# EAGLE schematic anookum_main (EAGLE 7.3.0)

## Sheet 1 of 5
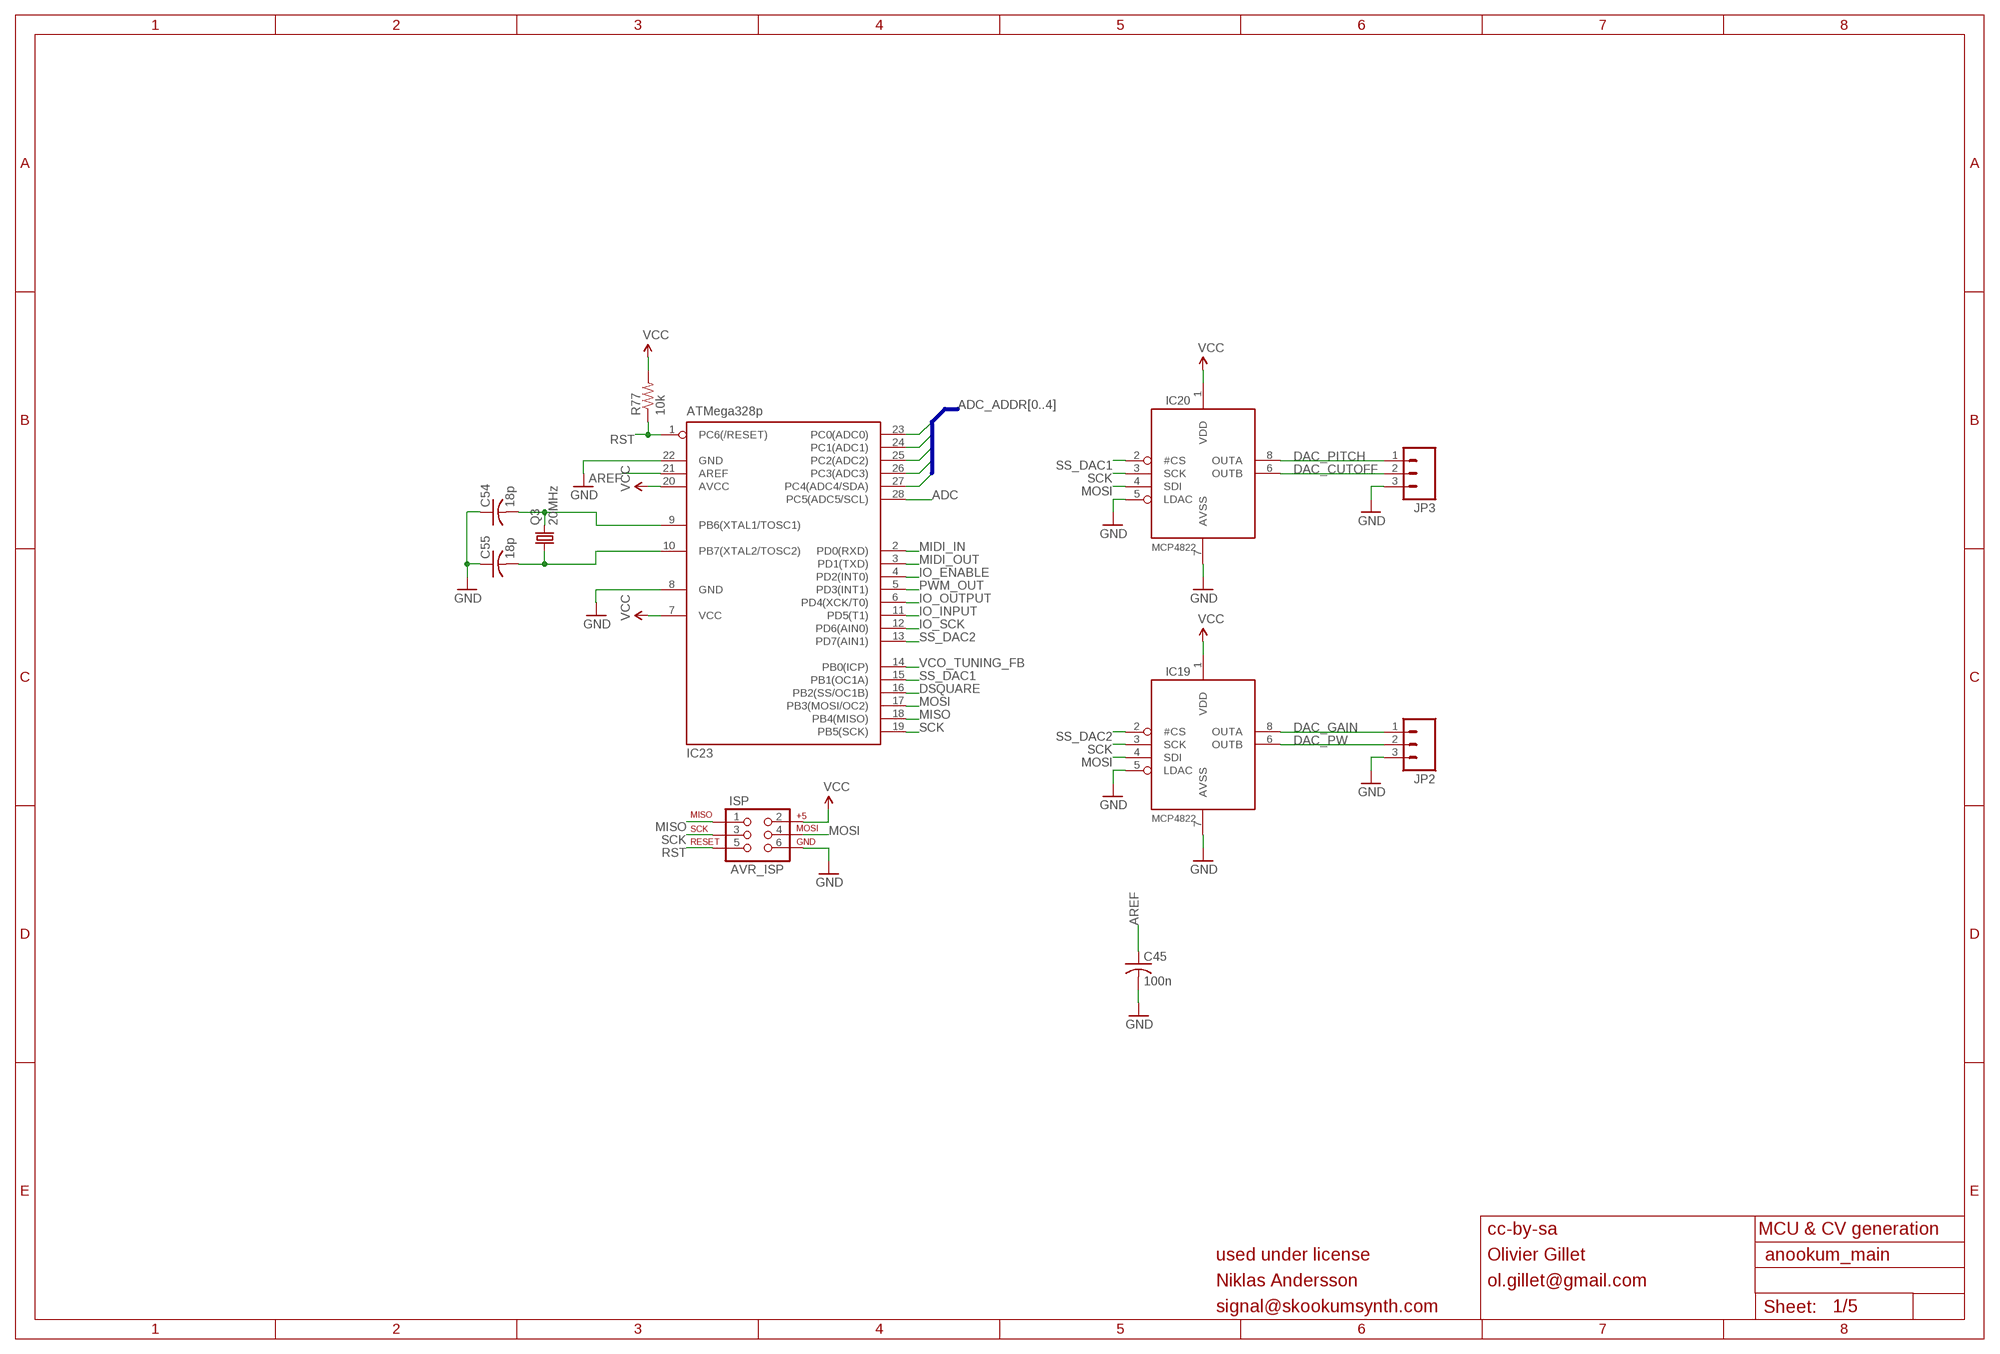
[diagram p0: schematic, sheet 1]

### Parts
C45  100n  C-US025-025X050  [C025-025X050]
C54  18p  C-US025-025X050  [C025-025X050]
C55  18p  C-US025-025X050  [C025-025X050]
IC19  MCP4822  [DIL08]
IC20  MCP4822  [DIL08]
IC23  ATMega328p  MEGA8-P  [DIL28-3]
ISP  AVR_ISP  AVR_SPI_PRG_6PTH  [2X3]
JP2  M03PTH  [1X03]
JP3  M03PTH  [1X03]
Q3  20MHz  CRYSTALHC49U-V  [HC49U-V]
R77  10k  R-US_0204/7  [0204/7]

### Nets
ADC: IC23.28(PC5(ADC5/SCL)) ; also sheet 2
ADC_ADDR0: IC23.25(PC2(ADC2)) ; also sheet 2
ADC_ADDR1: IC23.24(PC1(ADC1)) ; also sheet 2
ADC_ADDR2: IC23.23(PC0(ADC0)) ; also sheet 2
ADC_ADDR3: IC23.26(PC3(ADC3)) ; also sheet 2
ADC_ADDR4: IC23.27(PC4(ADC4/SDA)) ; also sheet 2
AREF: C45.1 IC23.21(AREF)
DAC_CUTOFF: IC20.6(OUTB) JP3.2 ; also sheet 2,4
DAC_GAIN: IC19.8(OUTA) JP2.1 ; also sheet 4
DAC_PITCH: IC20.8(OUTA) JP3.1 ; also sheet 2,3
DAC_PW: IC19.6(OUTB) JP2.2 ; also sheet 3
DSQUARE: IC23.16(PB2(SS/OC1B)) ; also sheet 3
GND: C45.2 C54.1 C55.1 IC19.5(LDAC) IC19.7(AVSS) IC20.5(LDAC) IC20.7(AVSS) IC23.8(GND) IC23.22(GND) ISP.6 JP2.3 JP3.3 ; also sheet 2,3,4,5
IO_ENABLE: IC23.4(PD2(INT0)) ; also sheet 2
IO_INPUT: IC23.11(PD5(T1)) ; also sheet 2
IO_OUTPUT: IC23.6(PD4(XCK/T0)) ; also sheet 2
IO_SCK: IC23.12(PD6(AIN0)) ; also sheet 2
MIDI_IN: IC23.2(PD0(RXD)) ; also sheet 2
MIDI_OUT: IC23.3(PD1(TXD)) ; also sheet 2
MISO: IC23.18(PB4(MISO)) ISP.1
MOSI: IC19.4(SDI) IC20.4(SDI) IC23.17(PB3(MOSI/OC2)) ISP.4
N$82: C55.2 IC23.10(PB7(XTAL2/TOSC2)) Q3.1
N$83: C54.2 IC23.9(PB6(XTAL1/TOSC1)) Q3.2
PWM_OUT: IC23.5(PD3(INT1)) ; also sheet 4
RST: IC23.1(PC6(/RESET)) ISP.5 R77.1
SCK: IC19.3(SCK) IC20.3(SCK) IC23.19(PB5(SCK)) ISP.3
SS_DAC1: IC20.2(#CS) IC23.15(PB1(OC1A))
SS_DAC2: IC19.2(#CS) IC23.13(PD7(AIN1))
VCC: IC19.1(VDD) IC20.1(VDD) IC23.7(VCC) IC23.20(AVCC) ISP.2 R77.2 ; also sheet 2,3,5
VCO_TUNING_FB: IC23.14(PB0(ICP)) ; also sheet 3

### Buses
ADC_ADDR[0..4]

### Notes on the sheet
- cc-by-sa | MCU & CV generation
- used under license | Olivier Gillet
- Niklas Andersson | ol.gillet@gmail.com
- signal@skookumsynth.com

## Sheet 2 of 5
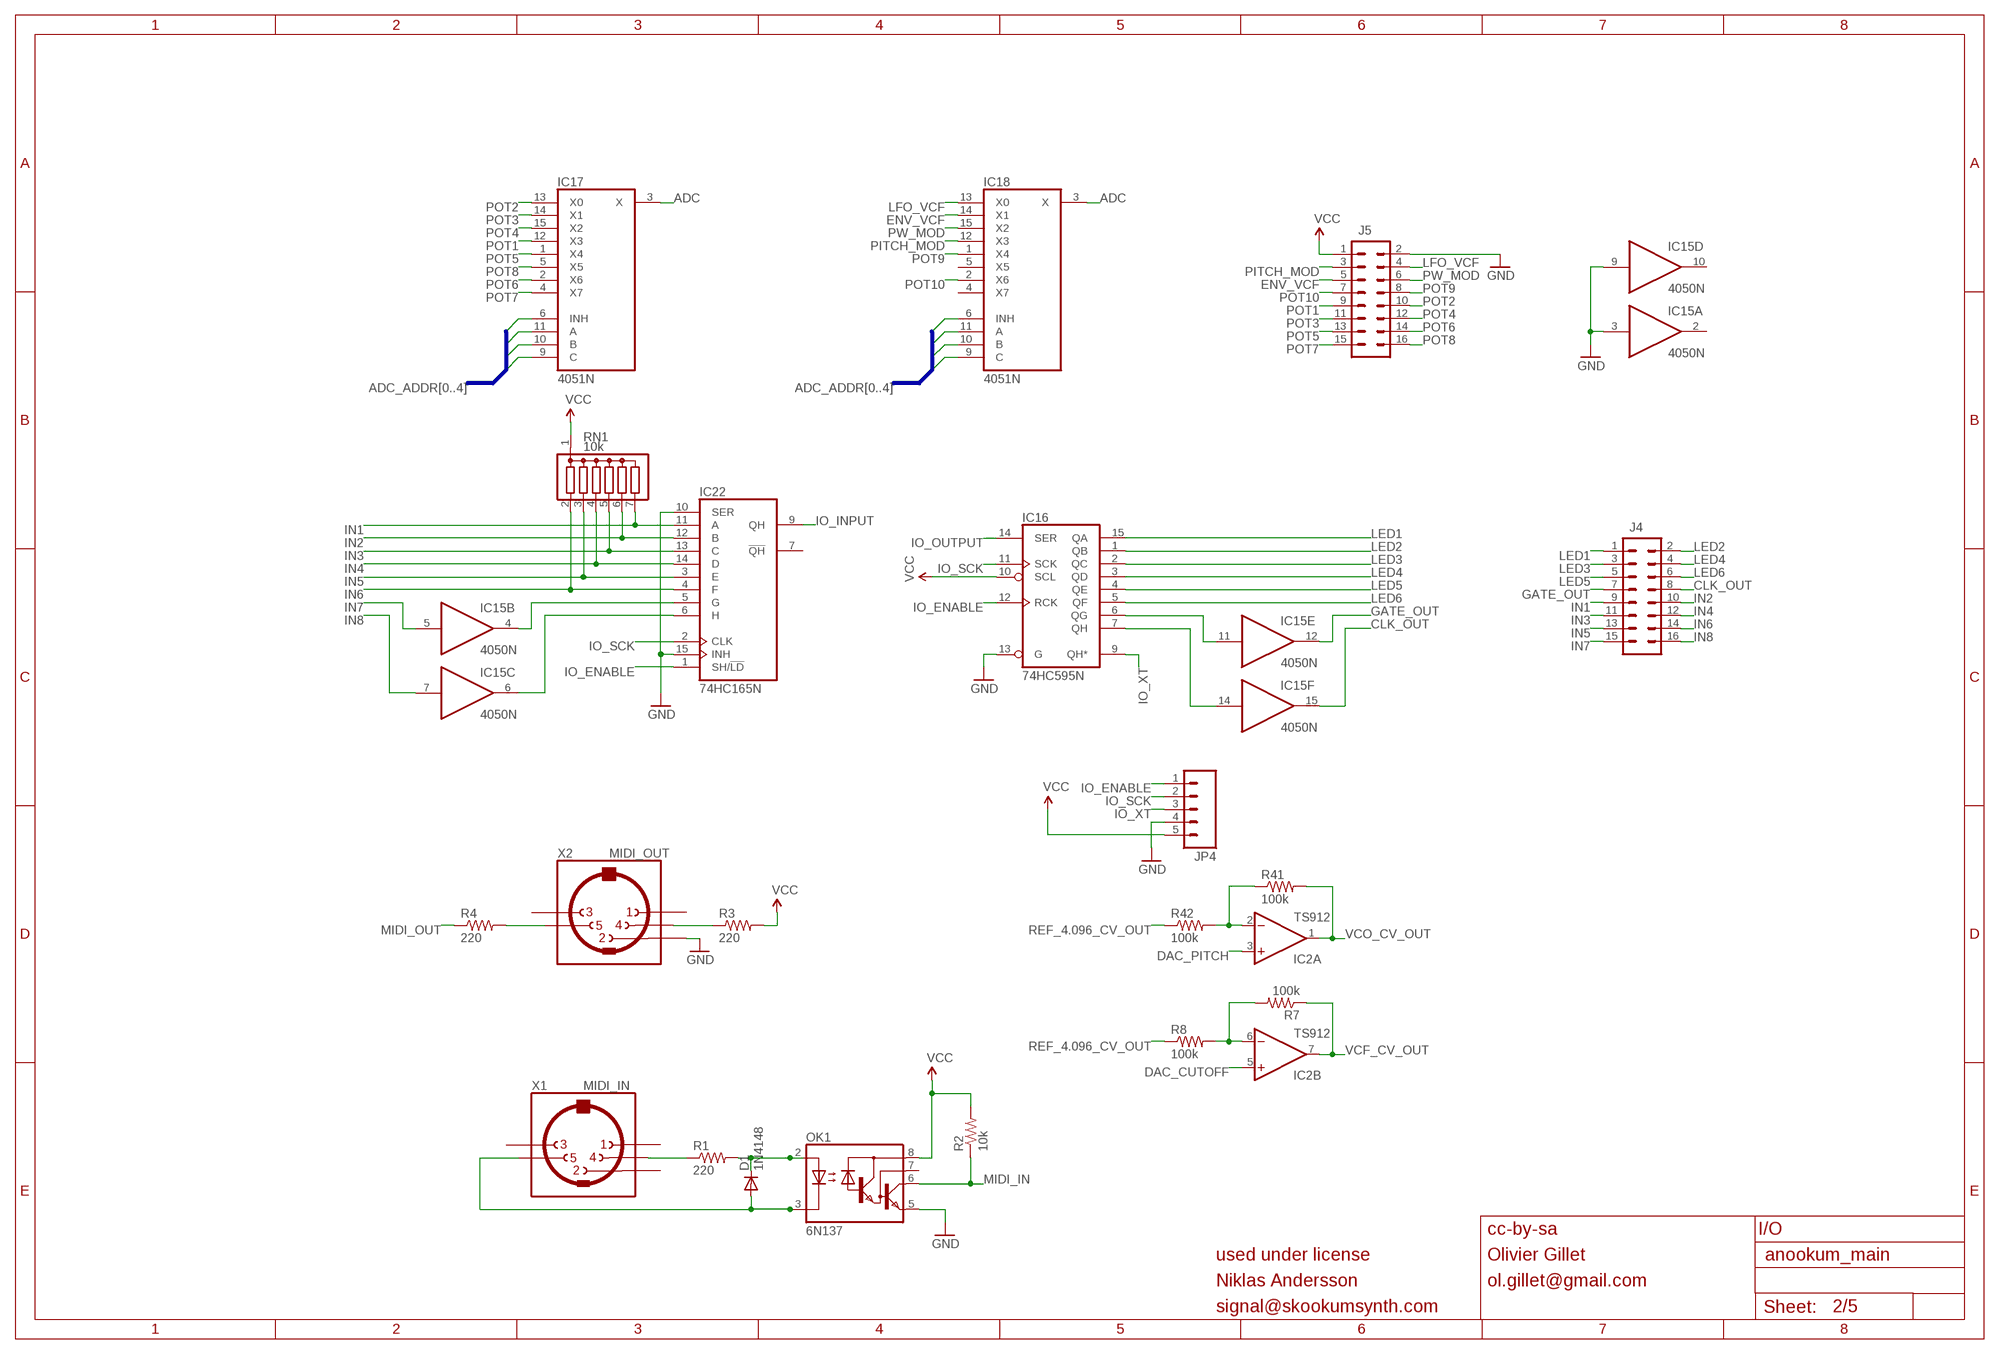
[diagram p1: schematic, sheet 2]

### Parts
D1  1N4148  DIODE-D-5  [D-5]
IC2  TS912  TL072P  [DIL08]
IC15  4050N  [DIL16]
IC16  74HC595N  [DIL16]
IC17  4051N  [DIL16]
IC18  4051N  [DIL16]
IC22  74HC165N  74LS165N  [DIL16]
J4  M08X2  [2X8]
J5  M08X2  [2X8]
JP4  M05PTH  [1X05]
OK1  6N137  6N138  [DIL08]
R1  220  R-US_0204/7  [0204/7]
R2  10k  R-US_0204/7  [0204/7]
R3  220  R-US_0204/7  [0204/7]
R4  220  R-US_0204/7  [0204/7]
R7  100k  R-US_0204/7  [0204/7]
R8  100k  R-US_0204/7  [0204/7]
R41  100k  R-US_0204/7  [0204/7]
R42  100k  R-US_0204/7  [0204/7]
RN1  10k  G06R  [SIL7]
X1  MIDI_IN  CONN_MIDI_F  [SDS-50J]
X2  MIDI_OUT  CONN_MIDI_F  [SDS-50J]

### Nets
ADC: IC17.3(X) IC18.3(X) ; also sheet 1
ADC_ADDR0: IC17.11(A) IC18.11(A) ; also sheet 1
ADC_ADDR1: IC17.10(B) IC18.10(B) ; also sheet 1
ADC_ADDR2: IC17.9(C) IC18.9(C) ; also sheet 1
ADC_ADDR3: IC17.6(INH) ; also sheet 1
ADC_ADDR4: IC18.6(INH) ; also sheet 1
CLK_OUT: IC15.15(F:O) J4.8
DAC_CUTOFF: IC2.5(B:+IN) ; also sheet 1,4
DAC_PITCH: IC2.3(A:+IN) ; also sheet 1,3
ENV_VCF: IC18.14(X1) J5.5
GATE_OUT: IC15.12(E:O) J4.7
GND: IC15.3(A:I) IC15.9(D:I) IC16.13(G) IC22.10(SER) IC22.15(INH) J5.2 JP4.4 OK1.5(GND) X2.2 ; also sheet 1,3,4,5
IN1: IC22.11(A) J4.9 RN1.7
IN2: IC22.12(B) J4.10 RN1.6
IN3: IC22.13(C) J4.11 RN1.5
IN4: IC22.14(D) J4.12 RN1.4
IN5: IC22.3(E) J4.13 RN1.3
IN6: IC22.4(F) J4.14 RN1.2
IN7: IC15.5(B:I) J4.15
IN8: IC15.7(C:I) J4.16
IO_ENABLE: IC16.12(RCK) IC22.1(SH/!LD) JP4.1 ; also sheet 1
IO_INPUT: IC22.9(QH) ; also sheet 1
IO_OUTPUT: IC16.14(SER) ; also sheet 1
IO_SCK: IC16.11(SCK) IC22.2(CLK) JP4.2 ; also sheet 1
IO_XT: IC16.9(QH*) JP4.3
LED1: IC16.15(QA) J4.1
LED2: IC16.1(QB) J4.2
LED3: IC16.2(QC) J4.3
LED4: IC16.3(QD) J4.4
LED5: IC16.4(QE) J4.5
LED6: IC16.5(QF) J4.6
LFO_VCF: IC18.13(X0) J5.4
MIDI_IN: OK1.6(VO) R2.1 ; also sheet 1
MIDI_IN4: R1.1 X1.4
MIDI_IN5: D1.A OK1.3(C) X1.5
MIDI_OUT: R4.1 ; also sheet 1
MIDI_OUT3: R3.1 X2.4
MIDI_OUT5: R4.2 X2.5
N$3: IC15.11(E:I) IC16.6(QG)
N$4: IC15.14(F:I) IC16.7(QH)
N$28: D1.C OK1.2(A) R1.2
N$43: IC15.4(B:O) IC22.5(G)
N$44: IC15.6(C:O) IC22.6(H)
N$71: IC2.2(A:-IN) R41.1 R42.2
N$75: IC2.6(B:-IN) R7.2 R8.2
PITCH_MOD: IC18.12(X3) J5.3
POT1: IC17.12(X3) J5.9
POT2: IC17.13(X0) J5.10
POT3: IC17.14(X1) J5.11
POT4: IC17.15(X2) J5.12
POT5: IC17.1(X4) J5.13
POT6: IC17.2(X6) J5.14
POT7: IC17.4(X7) J5.15
POT8: IC17.5(X5) J5.16
POT9: IC18.1(X4) J5.8
POT10: IC18.2(X6) J5.7
PW_MOD: IC18.15(X2) J5.6
REF_4.096_CV_OUT: R8.1 R42.1 ; also sheet 5
VCC: IC16.10(SCL) J5.1 JP4.5 OK1.8(VCC) R2.2 R3.2 RN1.1 ; also sheet 1,3,5
VCF_CV_OUT: IC2.7(B:OUT) R7.1 ; also sheet 4
VCO_CV_OUT: IC2.1(A:OUT) R41.2 ; also sheet 4
Unconnected: IC15.2(A:O) IC15.10(D:O) IC18.4(X7) IC18.5(X5) IC22.7(!QH) OK1.7(VB) X1.1 X1.2 X1.3 X2.1 X2.3

### Buses
ADC_ADDR[0..4]

### Notes on the sheet
- cc-by-sa | I/O
- used under license | Olivier Gillet
- Niklas Andersson | ol.gillet@gmail.com
- signal@skookumsynth.com

## Sheet 3 of 5
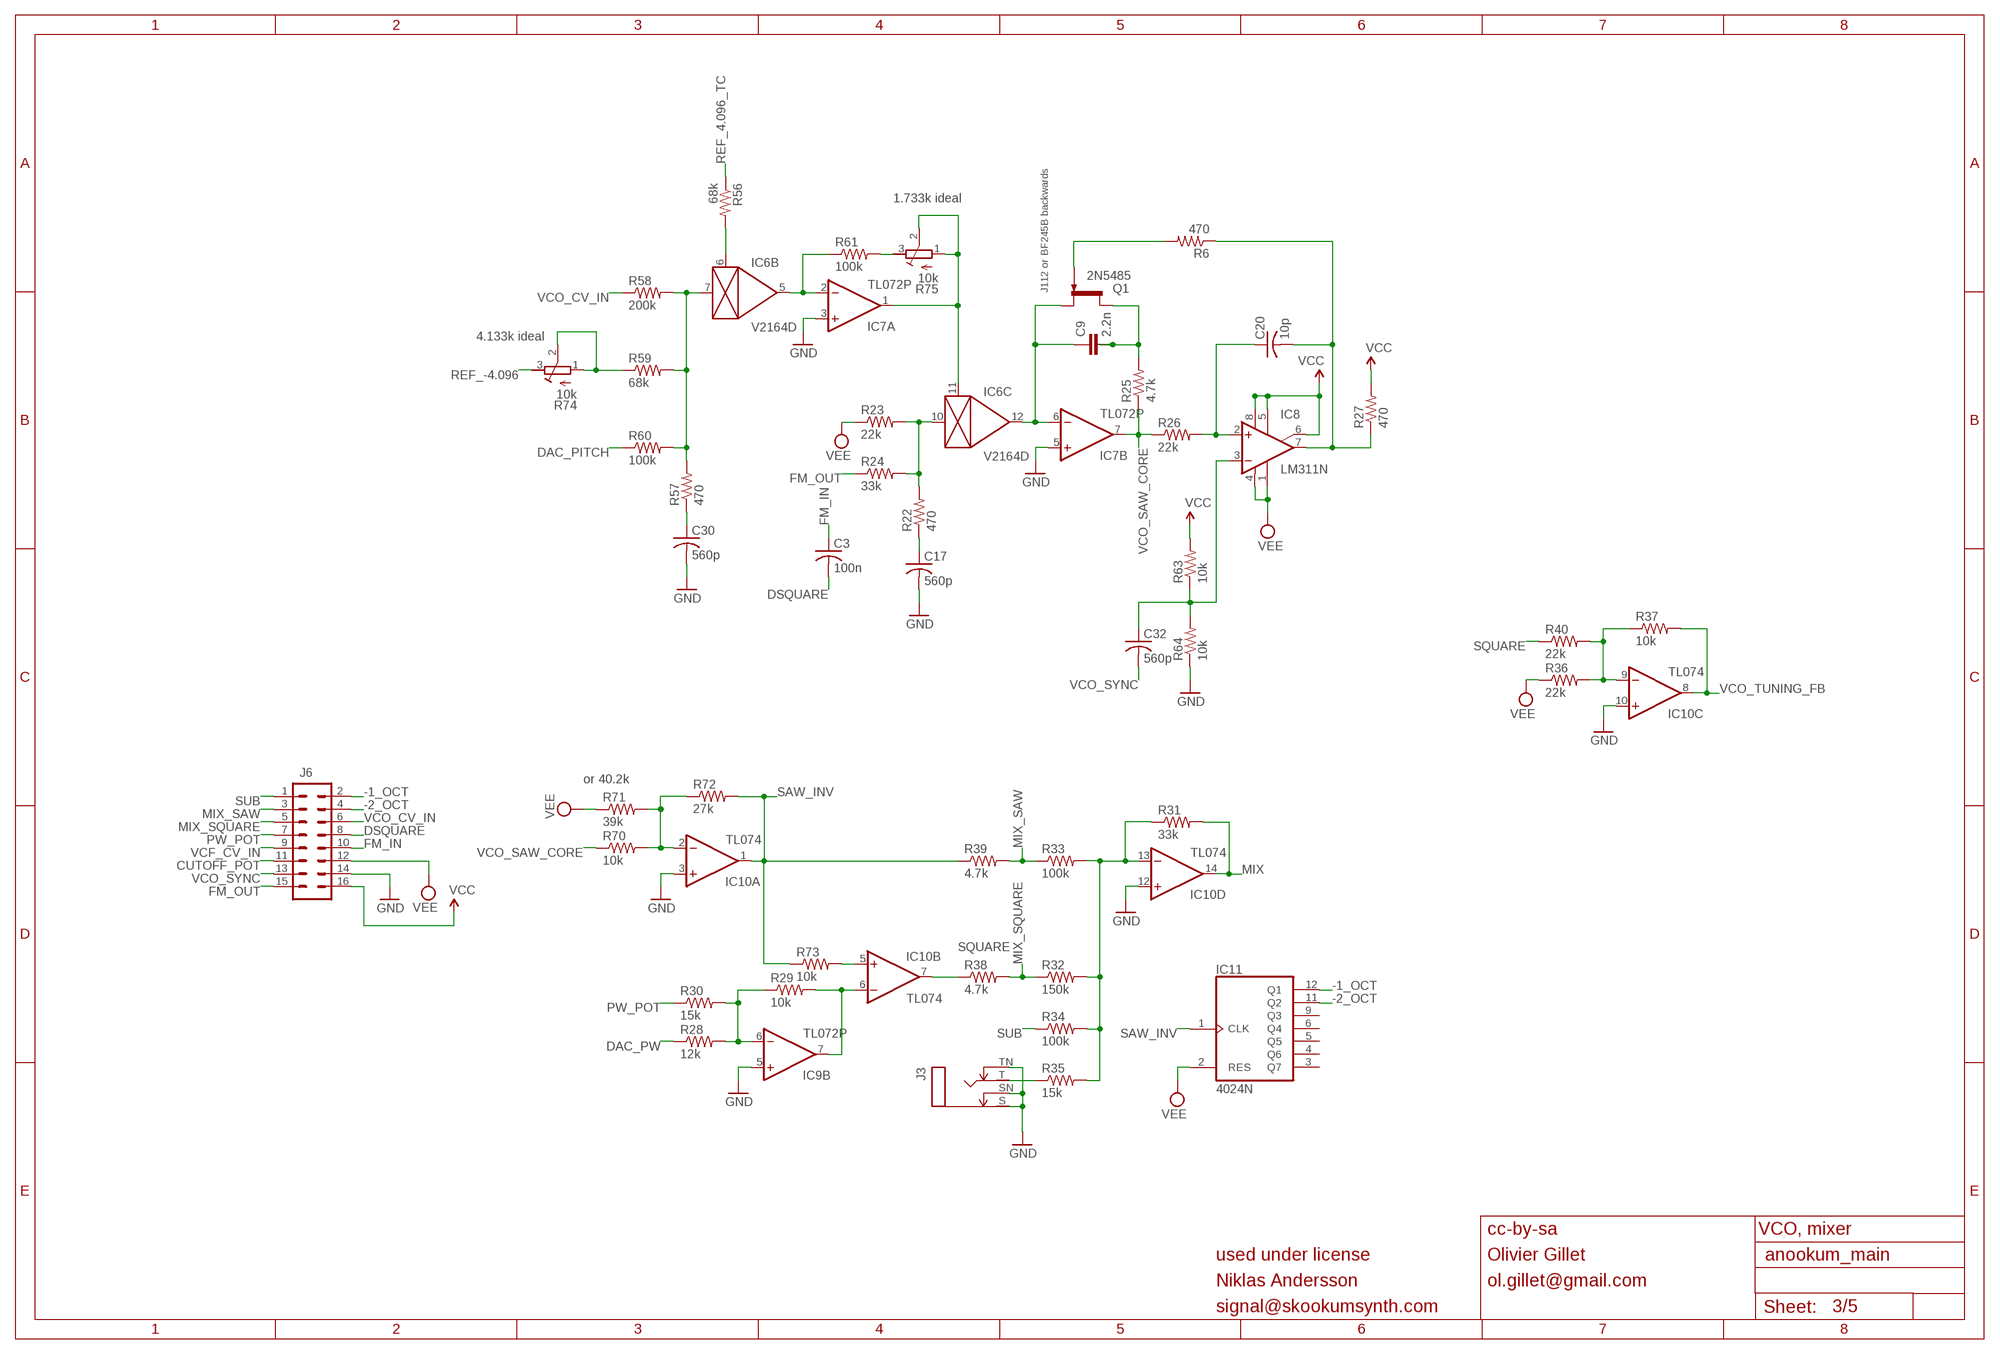
[diagram p2: schematic, sheet 3]

### Parts
C3  100n  C-US025-025X050  [C025-025X050]
C9  2.2n  C-2.5-5/5  [C2.5/5-5]
C17  560p  C-US025-025X050  [C025-025X050]
C20  10p  C-US025-025X050  [C025-025X050]
C30  560p  C-US025-025X050  [C025-025X050]
C32  560p  C-US025-025X050  [C025-025X050]
IC6  V2164D  SSM2164P  [DIL16]
IC7  TL072P  [DIL08]
IC8  LM311N  [DIL08]
IC9  TL072P  [DIL08]
IC10  TL074  TL084P  [DIL14]
IC11  4024N  [DIL14]
J3  MONOSWSLIM  [NRJ4HF]
J6  M08X2  [2X8]
Q1  2N5485  J201  [TO92-]
R6  470  R-US_0204/7  [0204/7]
R22  470  R-US_0204/7  [0204/7]
R23  22k  R-US_0204/7  [0204/7]
R24  33k  R-US_0204/7  [0204/7]
R25  4.7k  R-US_0204/7  [0204/7]
R26  22k  R-US_0204/7  [0204/7]
R27  470  R-US_0204/7  [0204/7]
R28  12k  R-US_0204/7  [0204/7]
R29  10k  R-US_0204/7  [0204/7]
R30  15k  R-US_0204/7  [0204/7]
R31  33k  R-US_0204/7  [0204/7]
R32  150k  R-US_0204/7  [0204/7]
R33  100k  R-US_0204/7  [0204/7]
R34  100k  R-US_0204/7  [0204/7]
R35  15k  R-US_0204/7  [0204/7]
R36  22k  R-US_0204/7  [0204/7]
R37  10k  R-US_0204/7  [0204/7]
R38  4.7k  R-US_0204/7  [0204/7]
R39  4.7k  R-US_0204/7  [0204/7]
R40  22k  R-US_0204/7  [0204/7]
R56  68k  R-US_0204/7  [0204/7]
R57  470  R-US_0204/7  [0204/7]
R58  200k  R-US_0204/7  [0204/7]
R59  68k  R-US_0204/7  [0204/7]
R60  100k  R-US_0204/7  [0204/7]
R61  100k  R-US_0204/7  [0204/7]
R63  10k  R-US_0204/7  [0204/7]
R64  10k  R-US_0204/7  [0204/7]
R70  10k  R-US_0204/7  [0204/7]
R71  39k  R-US_0204/7  [0204/7]
R72  27k  R-US_0204/7  [0204/7]
R73  10k  R-US_0204/7  [0204/7]
R74  10k  R-TRIMM3296W  [RTRIM3296W]
R75  10k  R-TRIMM3296W  [RTRIM3296W]

### Nets
-1_OCT: IC11.12(Q1) J6.2
-2_OCT: IC11.11(Q2) J6.4
CUTOFF_POT: J6.11 ; also sheet 4
DAC_PITCH: R60.1 ; also sheet 1,2
DAC_PW: R28.1 ; also sheet 1
DSQUARE: C3.2 J6.8 ; also sheet 1
FM_IN: C3.1 J6.10 ; also sheet 4
FM_OUT: J6.15 R24.1
GND: C17.2 C30.2 IC7.3(A:+IN) IC7.5(B:+IN) IC9.5(B:+IN) IC10.3(A:+IN) IC10.10(C:+IN) IC10.12(D:+IN) J3.S J3.SN J3.TN J6.14 R64.1 ; also sheet 1,2,4,5
MIX: IC10.14(D:OUT) R31.2 ; also sheet 4
MIX_SAW: J6.3 R33.1 R39.2
MIX_SQUARE: J6.5 R32.1 R38.2
N$1: IC6.11(C:CTRL) IC7.1(A:OUT) R75.1(E) R75.2(S)
N$2: C20.2 IC8.7(OUT) R6.1 R27.1
N$12: R61.2 R75.3(A)
N$16: Q1.1(G) R6.2
N$25: J3.T R35.1
N$47: R59.1 R74.1(E) R74.2(S)
N$51: C9.1 IC6.12(C:OUT) IC7.6(B:-IN) Q1.2(S)
N$57: C32.1 IC8.3(-IN) R63.1 R64.2
N$60: IC6.6(B:CTRL) R56.2
N$61: IC9.6(B:-IN) R28.2 R29.1 R30.2
N$62: IC6.7(B:IN) R57.2 R58.2 R59.2 R60.2
N$64: C30.1 R57.1
N$77: IC6.5(B:OUT) IC7.2(A:-IN) R61.1
N$79: IC6.10(C:IN) R22.2 R23.2 R24.2
N$80: C17.1 R22.1
N$81: IC9.7(B:OUT) IC10.6(B:-IN) R29.2
N$85: IC10.2(A:-IN) R70.2 R71.2 R72.1
N$86: C20.1 IC8.2(+IN) R26.2
N$91: IC10.5(B:+IN) R73.2
N$94: IC10.9(C:-IN) R36.2 R37.1 R40.2
N$98: IC10.13(D:-IN) R31.1 R32.2 R33.2 R34.2 R35.2
PW_POT: J6.7 R30.1
REF_4.096_TC: R56.1 ; also sheet 5
REF_-4.096: R74.3(A) ; also sheet 4,5
SAW_INV: IC10.1(A:OUT) IC11.1(CLK) R39.1 R72.2 R73.1
SQUARE: IC10.7(B:OUT) R38.1 R40.1
SUB: J6.1 R34.1
VCC: IC8.5(ON) IC8.6(ON/STR) IC8.8(V+) J6.16 R27.2 R63.2 ; also sheet 1,2,5
VCF_CV_IN: J6.9 ; also sheet 4
VCO_CV_IN: J6.6 R58.1
VCO_RAMP: C9.2 C9.3 Q1.3(D) R25.2
VCO_SAW_CORE: IC7.7(B:OUT) R25.1 R26.1 R70.1
VCO_SYNC: C32.2 J6.13
VCO_TUNING_FB: IC10.8(C:OUT) R37.2 ; also sheet 1
VEE: IC8.1(GND) IC8.4(V-) IC11.2(RES) J6.12 R23.1 R36.1 R71.1 ; also sheet 4,5
Unconnected: IC11.3(Q7) IC11.4(Q6) IC11.5(Q5) IC11.6(Q4) IC11.9(Q3)

### Notes on the sheet
- 1.733k ideal
- J112 or BF245B backwards
- 4.133k ideal
- or 40.2k
- cc-by-sa | VCO, mixer
- used under license | Olivier Gillet
- Niklas Andersson | ol.gillet@gmail.com
- signal@skookumsynth.com

## Sheet 4 of 5
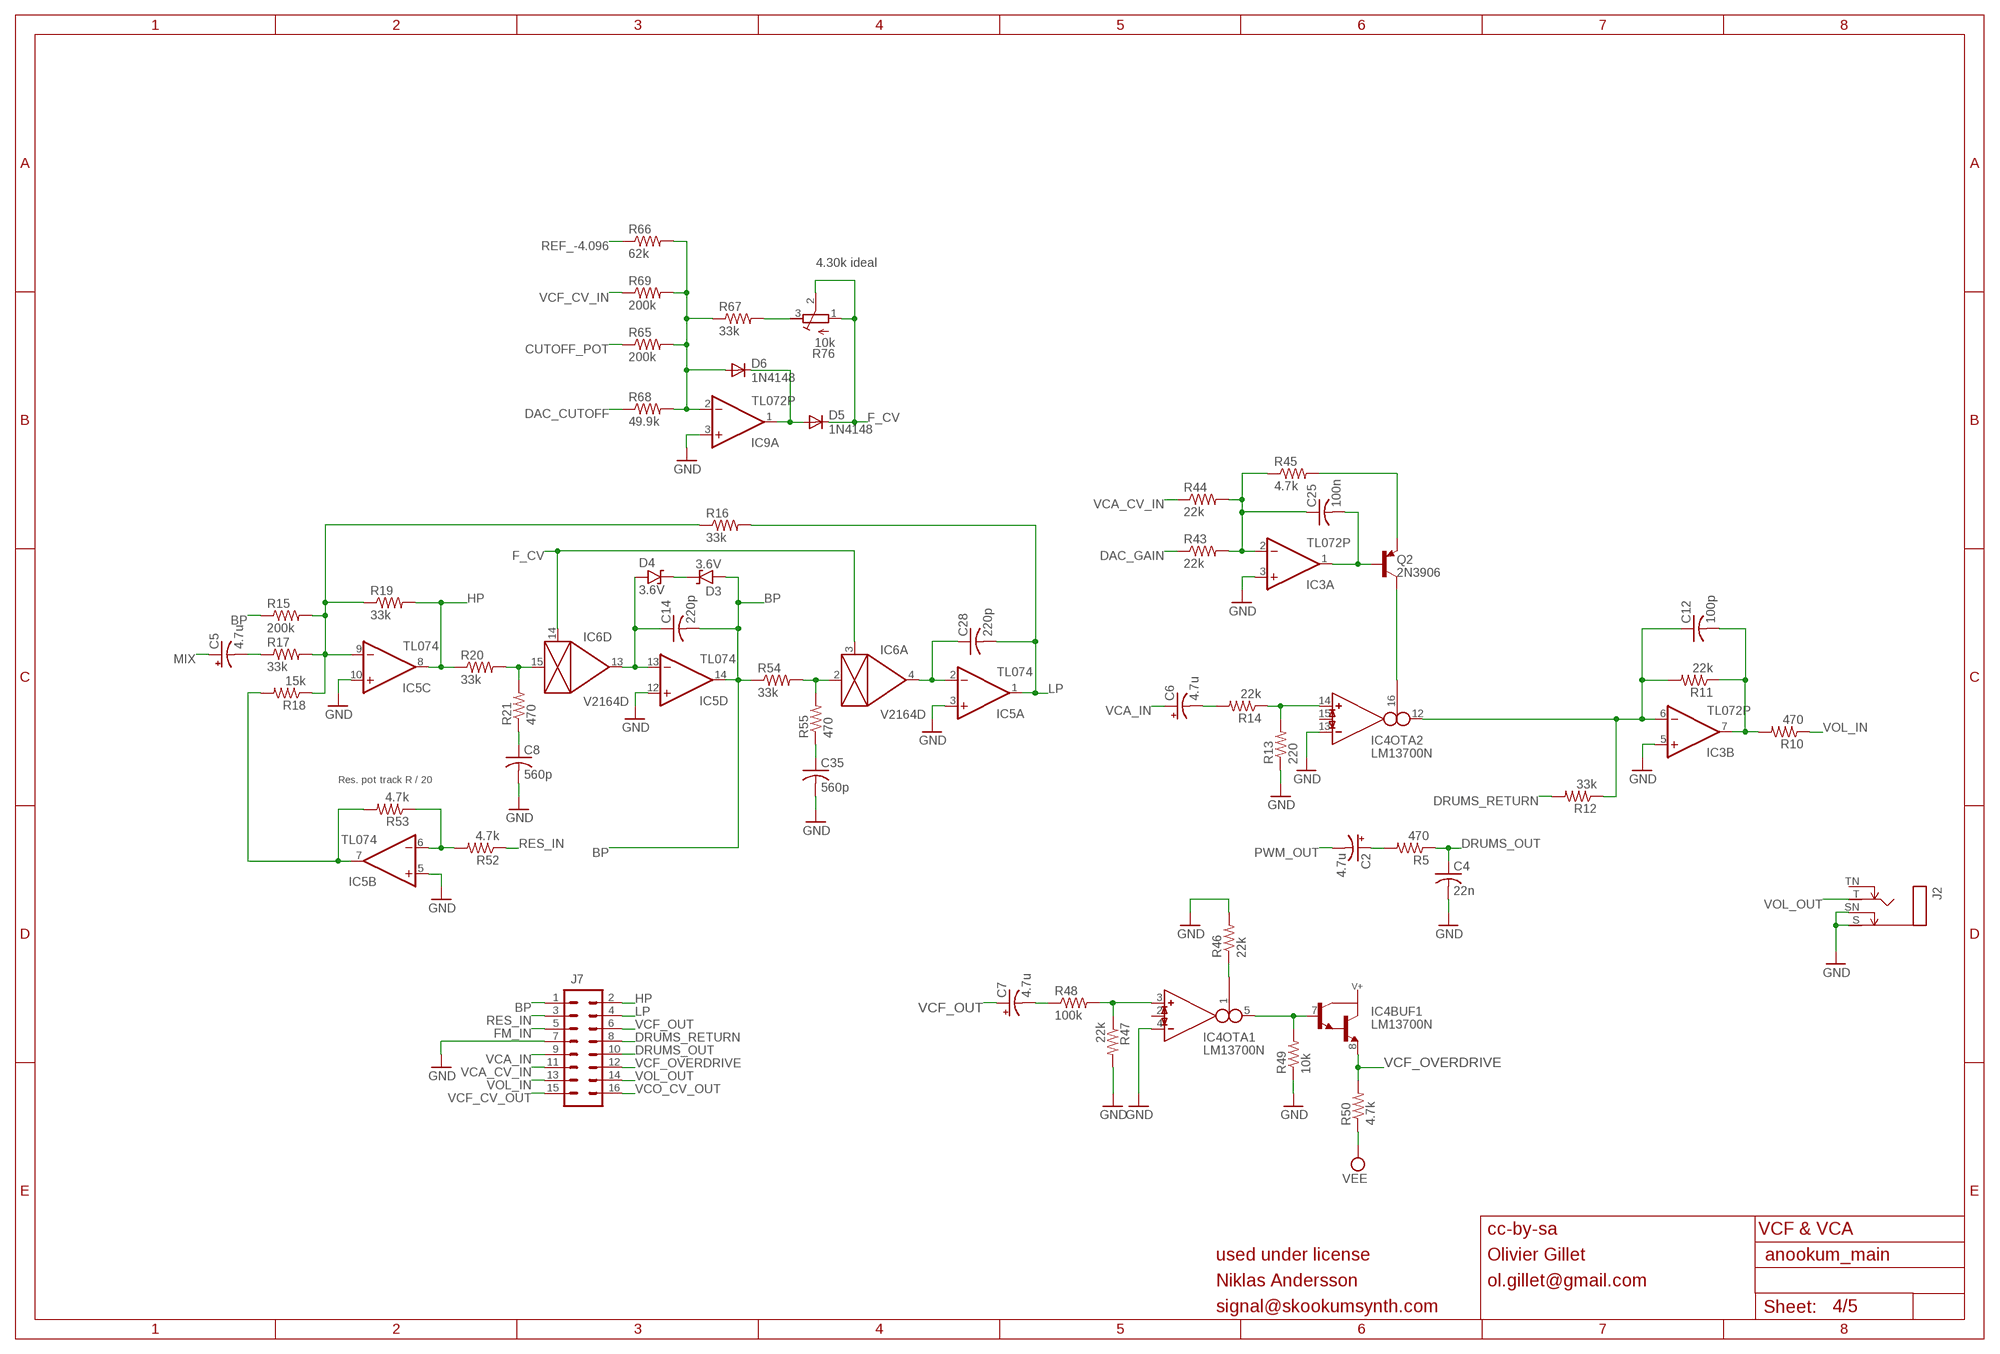
[diagram p3: schematic, sheet 4]

### Parts
C2  4.7u  CPOL-USE2.5-6  [E2,5-6]
C4  22n  C-US050-030X075  [C050-030X075]
C5  4.7u  CPOL-USE2.5-6  [E2,5-6]
C6  4.7u  CPOL-USE2.5-6  [E2,5-6]
C7  4.7u  CPOL-USE2.5-6  [E2,5-6]
C8  560p  C-US025-025X050  [C025-025X050]
C12  100p  C-US025-025X050  [C025-025X050]
C14  220p  C-US025-025X050  [C025-025X050]
C25  100n  C-US025-025X050  [C025-025X050]
C28  220p  C-US025-025X050  [C025-025X050]
C35  560p  C-US025-025X050  [C025-025X050]
D3  3.6V  1N47XXDO35  [D-5]
D4  3.6V  1N47XXDO35  [D-5]
D5  1N4148  DIODE-D-5  [D-5]
D6  1N4148  DIODE-D-5  [D-5]
IC3  TL072P  [DIL08]
IC4  LM13700N  [DIL16]
IC5  TL074  TL084P  [DIL14]
J2  MONOSWSLIM  [NRJ4HF]
J7  M08X2  [2X8]
Q2  2N3906  2N3906-  [TO92-]
R5  470  R-US_0204/7  [0204/7]
R10  470  R-US_0204/7  [0204/7]
R11  22k  R-US_0204/7  [0204/7]
R12  33k  R-US_0204/7  [0204/7]
R13  220  R-US_0204/7  [0204/7]
R14  22k  R-US_0204/7  [0204/7]
R15  200k  R-US_0204/7  [0204/7]
R16  33k  R-US_0204/7  [0204/7]
R17  33k  R-US_0204/7  [0204/7]
R18  15k  R-US_0204/7  [0204/7]
R19  33k  R-US_0204/7  [0204/7]
R20  33k  R-US_0204/7  [0204/7]
R21  470  R-US_0204/7  [0204/7]
R43  22k  R-US_0204/7  [0204/7]
R44  22k  R-US_0204/7  [0204/7]
R45  4.7k  R-US_0204/7  [0204/7]
R46  22k  R-US_0204/7  [0204/7]
R47  22k  R-US_0204/7  [0204/7]
R48  100k  R-US_0204/7  [0204/7]
R49  10k  R-US_0204/7  [0204/7]
R50  4.7k  R-US_0204/7  [0204/7]
R52  4.7k  R-US_0204/7  [0204/7]
R53  4.7k  R-US_0204/7  [0204/7]
R54  33k  R-US_0204/7  [0204/7]
R55  470  R-US_0204/7  [0204/7]
R65  200k  R-US_0204/7  [0204/7]
R66  62k  R-US_0204/7  [0204/7]
R67  33k  R-US_0204/7  [0204/7]
R68  49.9k  R-US_0204/7  [0204/7]
R69  200k  R-US_0204/7  [0204/7]
R76  10k  R-TRIMM3296W  [RTRIM3296W]

### Nets
BP: C14.2 D3.A IC5.14(D:OUT) J7.1 R15.1 R54.1
CUTOFF_POT: R65.1 ; also sheet 3
DAC_CUTOFF: R68.1 ; also sheet 1,2
DAC_GAIN: R43.1 ; also sheet 1
DRUMS_OUT: C4.1 J7.10 R5.1
DRUMS_RETURN: J7.8 R12.2
F_CV: D5.C IC6.3(A:CTRL) IC6.14(D:CTRL) R76.1(E) R76.2(S)
FM_IN: J7.5 ; also sheet 3
GND: C4.2 C8.2 C35.2 IC3.3(A:+IN) IC3.5(B:+IN) IC4.4(OTA1:IN_N) IC4.13(OTA2:IN_N) IC5.3(A:+IN) IC5.5(B:+IN) IC5.10(C:+IN) IC5.12(D:+IN) IC9.3(A:+IN) J2.S J2.SN J7.7 R13.1 R46.2 R47.2 R49.1 ; also sheet 1,2,3,5
HP: IC5.8(C:OUT) J7.2 R19.2 R20.1
LP: C28.2 IC5.1(A:OUT) J7.4 R16.2
MIX: C5.+ ; also sheet 3
N$5: C2.+ R5.2
N$9: IC5.9(C:-IN) R15.2 R16.1 R17.2 R18.1 R19.1
N$10: C28.1 IC5.2(A:-IN) IC6.4(A:OUT)
N$11: C8.1 R21.1
N$13: IC5.6(B:-IN) R52.2 R53.1
N$14: IC5.7(B:OUT) R18.2 R53.2
N$15: C5.- R17.1
N$17: C35.1 R55.1
N$19: C14.1 D4.A IC5.13(D:-IN) IC6.13(D:OUT)
N$21: R67.2 R76.3(A)
N$22: IC4.16(OTA2:I_BIAS) Q2.1(C)
N$26: IC6.2(A:IN) R54.2 R55.2
N$27: C7.- R48.1
N$29: IC6.15(D:IN) R20.2 R21.2
N$32: C6.- R14.2
N$38: D5.A D6.C IC9.1(A:OUT)
N$39: Q2.3(E) R45.2
N$40: D6.A IC9.2(A:-IN) R65.2 R66.2 R67.1 R68.2 R69.2
N$50: C25.2 IC3.1(A:OUT) Q2.2(B)
N$52: IC4.14(OTA2:IN_P) R13.2 R14.1
N$55: D3.C D4.C
N$63: C12.2 IC3.7(B:OUT) R10.2 R11.1
N$70: C12.1 IC3.6(B:-IN) IC4.12(OTA2:OUT) R11.2 R12.1
N$99: IC4.1(OTA1:I_BIAS) R46.1
N$101: IC4.3(OTA1:IN_P) R47.1 R48.2
N$103: IC4.5(OTA1:OUT) IC4.7(BUF1:B) R49.2
N$106: C25.1 IC3.2(A:-IN) R43.2 R44.2 R45.1
PWM_OUT: C2.- ; also sheet 1
REF_-4.096: R66.1 ; also sheet 3,5
RES_IN: J7.3 R52.1
VCA_CV_IN: J7.11 R44.1
VCA_IN: C6.+ J7.9
VCF_CV_IN: R69.1 ; also sheet 3
VCF_CV_OUT: J7.15 ; also sheet 2
VCF_OUT: C7.+ J7.6
VCF_OVERDRIVE: IC4.8(BUF1:E) J7.12 R50.2
VCO_CV_OUT: J7.16 ; also sheet 2
VEE: R50.1 ; also sheet 3,5
VOL_IN: J7.13 R10.1
VOL_OUT: J2.T J7.14
Unconnected: IC4.2(OTA1:I_DIODE) IC4.9(BUF2:E) IC4.10(BUF2:B) IC4.15(OTA2:I_DIODE) J2.TN

### Notes on the sheet
- 4.30k ideal
- Res. pot track R / 20
- cc-by-sa | VCF & VCA
- used under license | Olivier Gillet
- Niklas Andersson | ol.gillet@gmail.com
- signal@skookumsynth.com

## Sheet 5 of 5
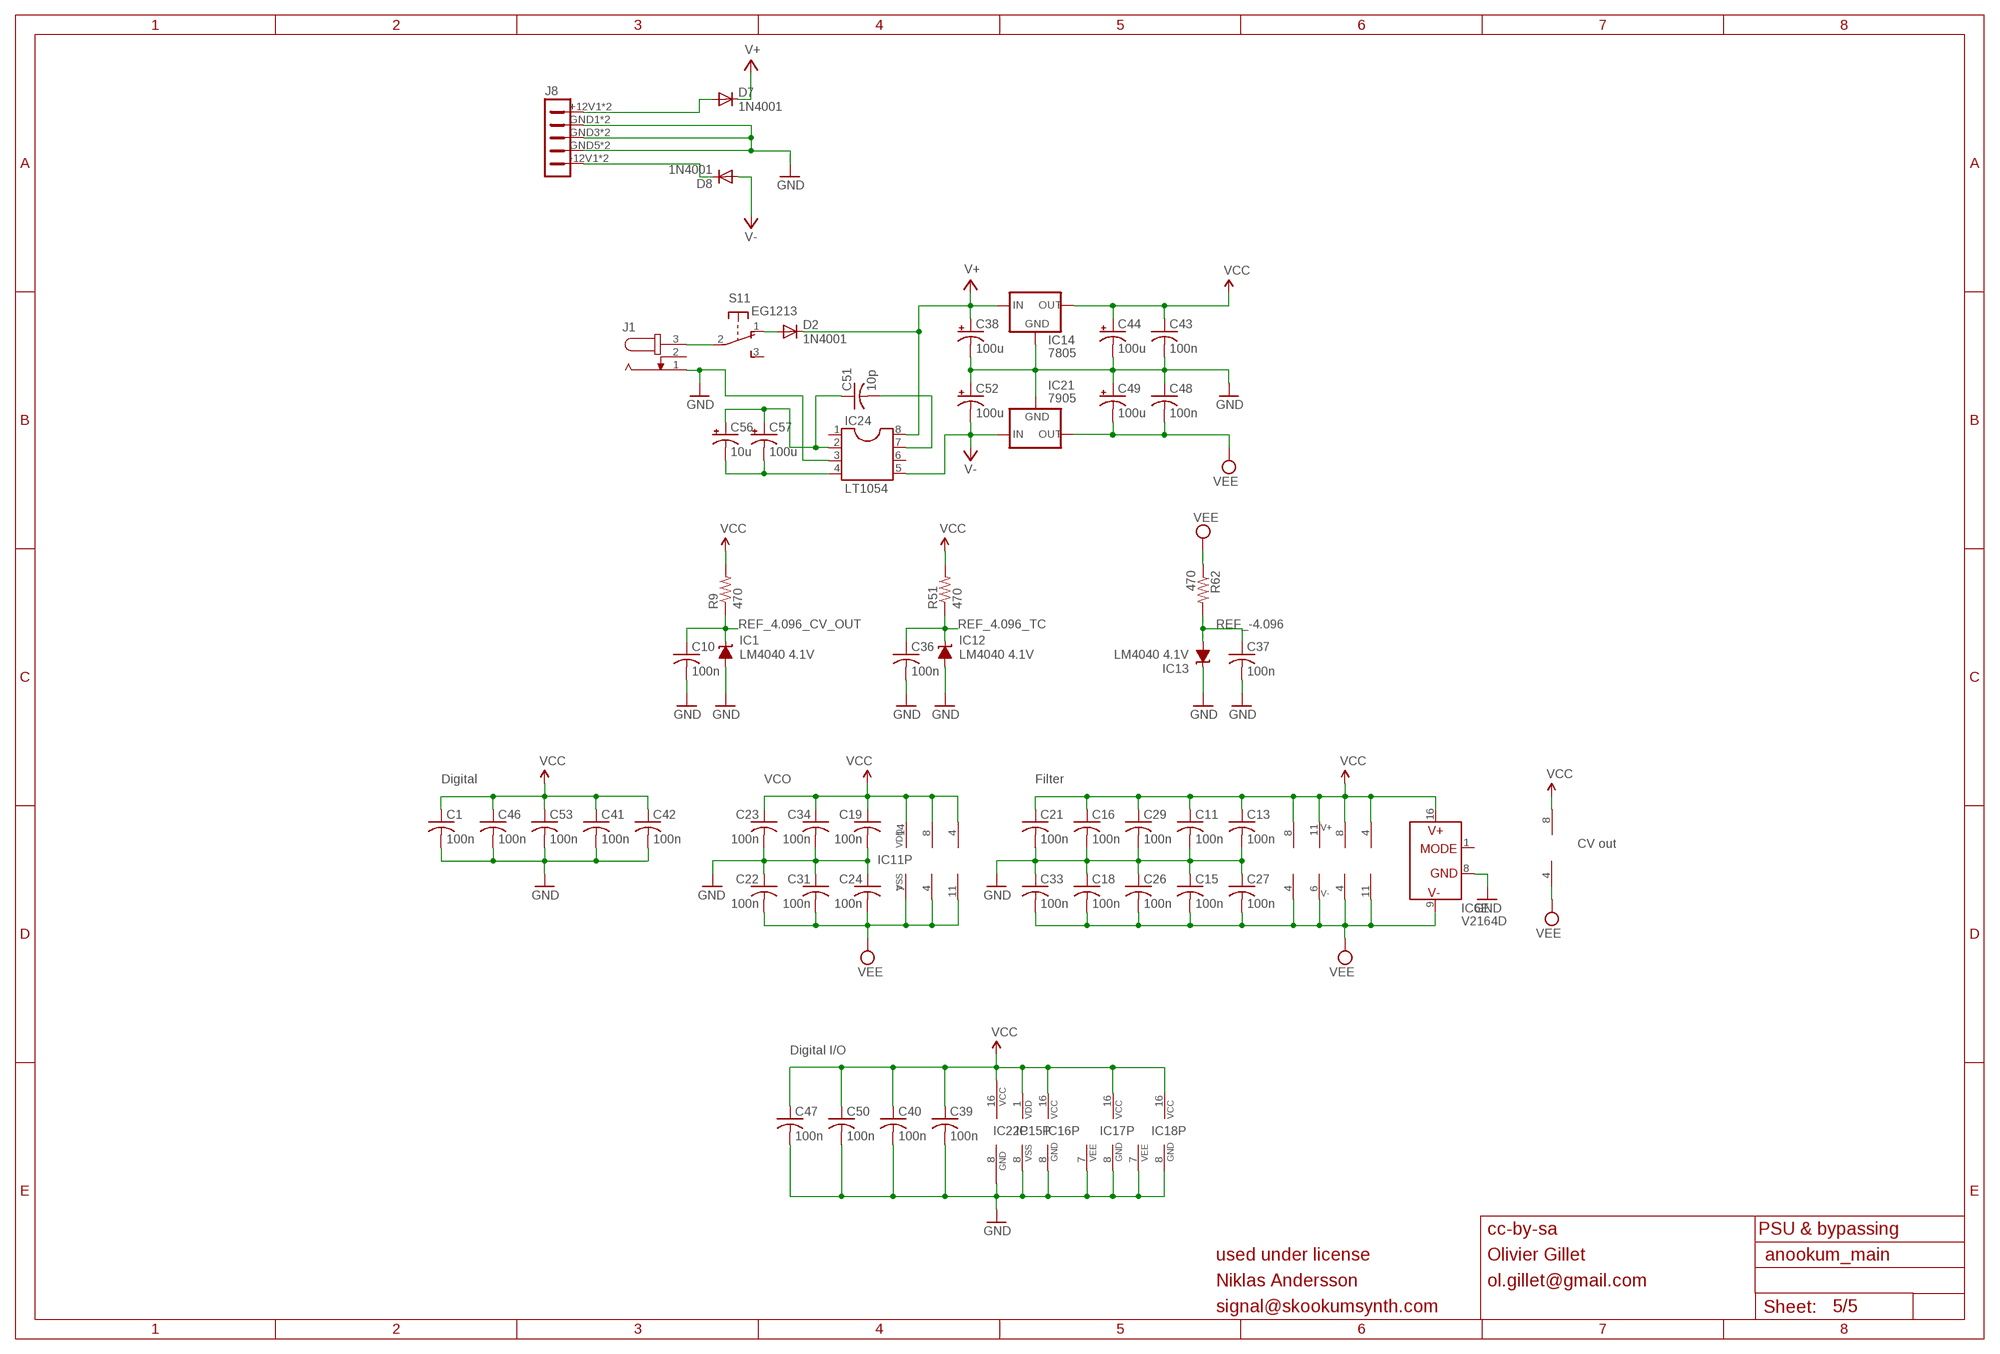
[diagram p4: schematic, sheet 5]

### Parts
C1  100n  C-US025-025X050  [C025-025X050]
C10  100n  C-US025-025X050  [C025-025X050]
C11  100n  C-US025-025X050  [C025-025X050]
C13  100n  C-US025-025X050  [C025-025X050]
C15  100n  C-US025-025X050  [C025-025X050]
C16  100n  C-US025-025X050  [C025-025X050]
C18  100n  C-US025-025X050  [C025-025X050]
C19  100n  C-US025-025X050  [C025-025X050]
C21  100n  C-US025-025X050  [C025-025X050]
C22  100n  C-US025-025X050  [C025-025X050]
C23  100n  C-US025-025X050  [C025-025X050]
C24  100n  C-US025-025X050  [C025-025X050]
C26  100n  C-US025-025X050  [C025-025X050]
C27  100n  C-US025-025X050  [C025-025X050]
C29  100n  C-US025-025X050  [C025-025X050]
C31  100n  C-US025-025X050  [C025-025X050]
C33  100n  C-US025-025X050  [C025-025X050]
C34  100n  C-US025-025X050  [C025-025X050]
C36  100n  C-US025-025X050  [C025-025X050]
C37  100n  C-US025-025X050  [C025-025X050]
C38  100u  CPOL-USE2.5-7  [E2,5-7]
C39  100n  C-US025-025X050  [C025-025X050]
C40  100n  C-US025-025X050  [C025-025X050]
C41  100n  C-US025-025X050  [C025-025X050]
C42  100n  C-US025-025X050  [C025-025X050]
C43  100n  C-US025-025X050  [C025-025X050]
C44  100u  CPOL-USE2.5-7  [E2,5-7]
C46  100n  C-US025-025X050  [C025-025X050]
C47  100n  C-US025-025X050  [C025-025X050]
C48  100n  C-US025-025X050  [C025-025X050]
C49  100u  CPOL-USE2.5-7  [E2,5-7]
C50  100n  C-US025-025X050  [C025-025X050]
C51  10p  C-US025-025X050  [C025-025X050]
C52  100u  CPOL-USE2.5-7  [E2,5-7]
C53  100n  C-US025-025X050  [C025-025X050]
C56  10u  CPOL-USE2.5-5  [E2,5-5]
C57  100u  CPOL-USE2.5-6  [E2,5-6]
D2  1N4001  1N4004  [DO41-10]
D7  1N4001  1N4004  [DO41-10]
D8  1N4001  1N4004  [DO41-10]
IC1  LM4040 4.1V  LM4041C12LP  [LP_O-PBCY-W3]
IC12  LM4040 4.1V  LM4041C12LP  [LP_O-PBCY-W3]
IC13  LM4040 4.1V  LM4041C12LP  [LP_O-PBCY-W3]
IC14  7805  78XXS  [78XXS]
IC21  7905  79XXS  [79XXS]
IC24  LT1054  DIL8  [DIL08]
J1  JACK-PLUG2  [SPC4078_BIG_HOLES]
J8  HDR_POWER_10_VERT  [HDR_POWER_10]
R9  470  R-US_0204/7  [0204/7]
R51  470  R-US_0204/7  [0204/7]
R62  470  R-US_0204/7  [0204/7]
S1  EG1213  [EG1213]

### Nets
GND: C1.2 C10.2 C11.2 C13.2 C15.1 C16.2 C18.1 C19.2 C21.2 C22.1 C23.2 C24.1 C26.1 C27.1 C29.2 C31.1 C33.1 C34.2 C36.2 C37.2 C38.- C39.2 C40.2 C41.2 C42.2 C43.2 C44.- C46.2 C47.2 C48.1 C49.+ C50.2 C52.+ C53.2 IC1.3(A) IC6.8(E:GND) IC12.3(A) IC13.2(C) IC14.GND IC15.8(P:VSS) IC16.8(GND) IC17.7(VEE) IC17.8(GND) IC18.7(VEE) IC18.8(GND) IC21.GND IC22.8(GND) IC24.3 J1.1 J8.GND1 J8.GND2 J8.GND3 J8.GND4 J8.GND5 J8.GND6 ; also sheet 1,2,3,4
N$6: J1.3 S1.2(1:P)
N$7: D2.A S1.1(1:O)
N$8: C51.1 C56.+ C57.+ IC24.2
N$18: D7.A J8.+12V1 J8.+12V2
N$20: D8.C J8.-12V1 J8.-12V2
N$48: C56.- C57.- IC24.4
N$49: C51.2 IC24.7
REF_4.096_CV_OUT: C10.1 IC1.2(C) R9.1 ; also sheet 2
REF_4.096_TC: C36.1 IC12.2(C) R51.1 ; also sheet 3
REF_-4.096: C37.1 IC13.3(A) R62.2 ; also sheet 3,4
V+: C38.+ D2.C D7.C IC14.IN IC24.8
V-: C52.- D8.A IC21.IN IC24.5
VCC: C1.1 C11.1 C13.1 C16.1 C19.1 C21.1 C23.1 C29.1 C34.1 C39.1 C40.1 C41.1 C42.1 C43.1 C44.+ C46.1 C47.1 C50.1 C53.1 IC2.8(P:V+) IC3.8(P:V+) IC4.11(SUPPLY:V+) IC5.4(P:V+) IC6.16(E:V+) IC7.8(P:V+) IC9.8(P:V+) IC10.4(P:V+) IC11.14(VDD) IC14.OUT IC15.1(P:VDD) IC16.16(VCC) IC17.16(VCC) IC18.16(VCC) IC22.16(VCC) R9.2 R51.2 ; also sheet 1,2,3
VEE: C15.2 C18.2 C22.2 C24.2 C26.2 C27.2 C31.2 C33.2 C48.2 C49.- IC2.4(P:V-) IC3.4(P:V-) IC4.6(SUPPLY:V-) IC5.11(P:V-) IC6.9(E:V-) IC7.4(P:V-) IC9.4(P:V-) IC10.11(P:V-) IC11.7(VSS) IC21.OUT R62.1 ; also sheet 3,4
Unconnected: IC6.1(E:MODE) IC24.1 IC24.6 J1.2 S1.3(1:S) S1.MT1(MT) S1.MT2(MT)

### Notes on the sheet
- Digital | VCO | Filter
- CV out
- Digital I/O
- cc-by-sa | PSU & bypassing
- used under license | Olivier Gillet
- Niklas Andersson | ol.gillet@gmail.com
- signal@skookumsynth.com

## Library data of the parts
C1 C3 C4 C8 C10-C37 C39-C43 C45-C48 C50 C51 C53-C55 = rcl:C-US: CAPACITOR, American symbol
C2 C5-C7 C38 C44 C49 C52 C56 C57 = rcl:CPOL-US: POLARIZED CAPACITOR, American symbol
C9 = capacitor-wima:C-: CAPACITOR for alternative placement naming: default grid - extended grid/package width
D1 D5 D6 = diode:DIODE-: DIODE
D2 D7 D8 = diode:1N4004: DIODE general purpose rectifier, 1 A
D3 D4 = og-diodes:1N47XX: Zener Diode 1N4728 - 1N4764: 3.3 V - 100V, 10% (1n47xxA 5%); DO-41 glass case
IC1 IC12 IC13 = texas:LM4041: PRECISION MICROPOWER SHUNT VOLTAGE REFERENCE Source: http://focus.ti.com/lit/ds/slcs146e/slcs146e.pdf
IC2 IC3 IC7 IC9 = og-linear:TL072: OP AMP
IC4 = ota:LM13700: Dual OTA with buffers
IC5 IC10 = linear:TL084: OP AMP
IC6 = ssm2164:SSM2164
IC8 = og-linear:LM311: COMPARATOR
IC11 = 40xx:4024: 7-stage binary/ripple COUNTER
IC14 = v-reg:78XXS: VOLTAGE REGULATOR
IC15 = 40xx:4050: Hex non-inverting BUFFER
IC16 = 74xx-eu:74*595: 8-bit SHIFT REGISTER, output latch
IC17 IC18 = 40xx:4051: 8-channel ANALOG MULTIPLEXER
IC19 IC20 = og-dac:MCP4822
IC21 = v-reg:79XXS: VOLTAGE REGULATOR
IC22 = 74xx-us:74*165: 8-bit parallel load SHIFT REGISTER
IC23 = atmel:MEGA8-P: MICROCONTROLLER 8 Kbytes FLASH, 1 kbytes SRAM, 512 bytes EEPROM, USART, 4-channel 10 bit ADC, 2-channel 8 bit ADC Pin compatible with Atmega48, ATMega88, ATMega168 Source: avr.lbr
IC24 = ic-package:DIL8: Dual In Line / Socket
ISP = SparkFun:AVR_SPI_PRG_6: AVR ISP 6 Pin This is the reduced ISP connector for AVR programming. Common on Arduino. This footprint will take up less PCB space and can be used with a 10-pin to 6-pin adapter such as SKU: BOB-08508
J1 = con-jack2:JACK-PLUG: DC POWER JACK Power Jack, DC, Right Angle, Through Hole, Rated 5A at 16VDC, PC Terminals Distributor: Farnell (www.Farnell.de) Drawing: 84N1161.pdf / 84N1162.pdf Manufacturer: SPC Technology (www.spctechnology.com) Type: SPC4077 / SPC 4078
J2 J3 = og-neutrik:MONOSW
J4-J7 = SparkFun:M08X2
J8 = 000:HDR_POWER_10: 10 Pin Euroack power header with -12V indication CNC Tech P/N: 3020-10-0100-00 - VERTICAL 3020-10-0200-00 - RIGHT ANGLE
JP2 JP3 = SparkFun:M03: Header 3 Standard 3-pin 0.1" header. Use with straight break away headers (SKU : PRT-00116), right angle break away headers (PRT-00553), swiss pins (PRT-00743), machine pins (PRT-00117), and female headers (PRT-00115). Molex polarized connector foot print use with SKU : PRT-08232 with associated crimp pins and housings.
JP4 = SparkFun:M05: Header 5 Standard 5-pin 0.1" header. Use with straight break away headers (SKU : PRT-00116), right angle break away headers (PRT-00553), swiss pins (PRT-00743), machine pins (PRT-00117), and female headers (PRT-00115). Molex polarized connector foot print use with SKU : PRT-08230 with associated crimp pins and housings.
OK1 = optocoupler:6N138: MOTOROLA OPTO COUPLER
Q1 = gm-trans:J201: N-channel JFET
Q2 = gm-trans:2N3906: PNP Transistor
Q3 = crystal:CRYSTAL: CRYSTAL
R1-R8 R10-R50 R52-R61 R63-R73 R77 = rcl:R-US_: RESISTOR, American symbol
R9 R51 R62 = resistor:R-US_: RESISTOR, American symbol
R74-R76 = rcl:R-TRIMM: Trimm resistor
RN1 = resistor-sil:G06R: SIL RESISTOR
S1 = adafruit:EG1213: E-Switch right-angle slide SPDT Part #EG1213 http://www.ladyada.net/library/eagle
X1 X2 = 000:CONN_MIDI_F